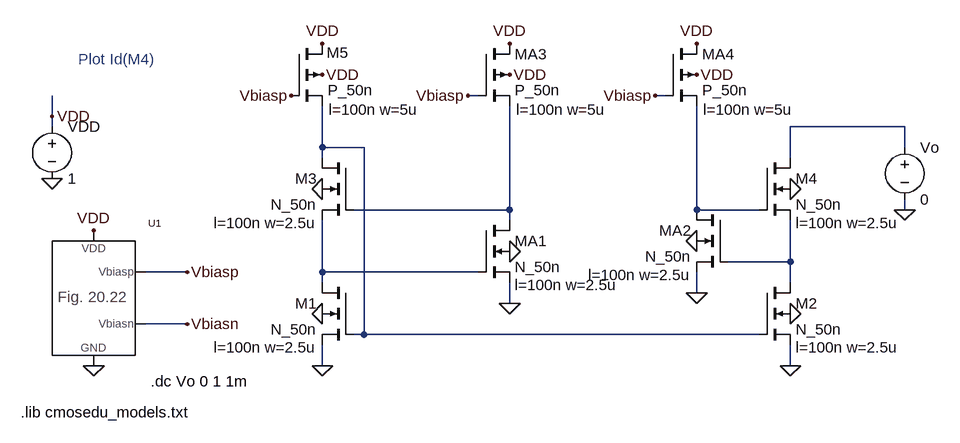
[diagram p0: schematic Fig20_42.asc]
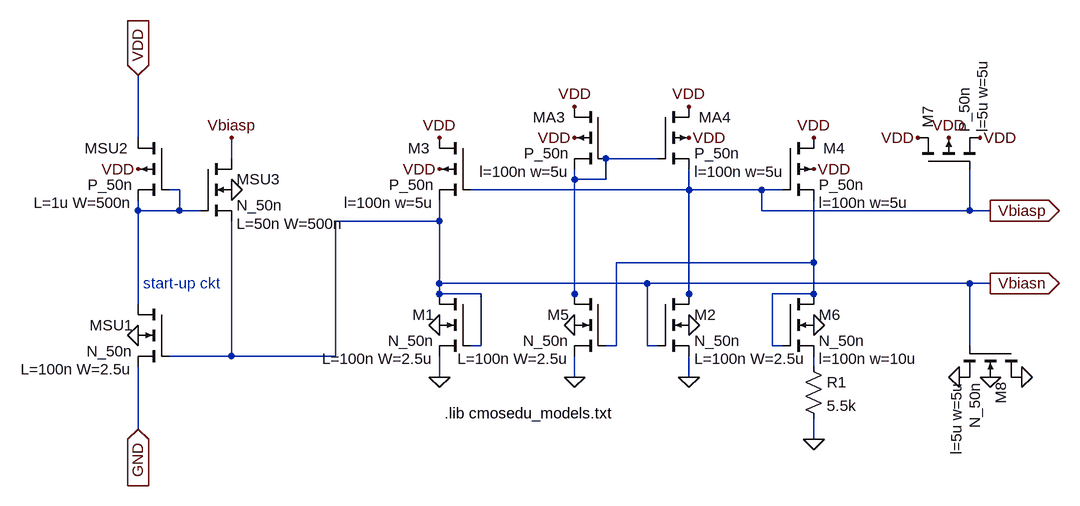
[diagram p1: sub-circuit fig_20_22.asc]
Fig20_42.asc, the LTspice schematic file:
Version 4
SHEET 1 1820 680
WIRE 448 -208 448 -240
WIRE 448 -192 448 -208
WIRE 656 32 592 32
WIRE 656 112 592 112
WIRE 864 -160 864 -224
WIRE 864 -144 864 -160
WIRE 864 32 864 -48
WIRE 864 48 864 32
WIRE 864 176 864 144
WIRE 928 -160 864 -160
WIRE 928 128 912 128
WIRE 928 128 928 -160
WIRE 1104 -240 1088 -240
WIRE 1104 32 864 32
WIRE 1152 -64 912 -64
WIRE 1152 -64 1152 -224
WIRE 1152 -48 1152 -64
WIRE 1152 80 1152 48
WIRE 1392 -240 1376 -240
WIRE 1440 -64 1440 -224
WIRE 1440 64 1440 32
WIRE 1536 -64 1440 -64
WIRE 1536 128 928 128
WIRE 1584 -144 1584 -192
WIRE 1584 16 1488 16
WIRE 1584 16 1584 -48
WIRE 1584 48 1584 16
WIRE 1584 176 1584 144
WIRE 1760 -192 1584 -192
WIRE 1760 -160 1760 -192
WIRE 1760 -64 1760 -80
FLAG 448 -112 0
FLAG 448 -208 VDD
FLAG 512 -32 VDD
FLAG 512 176 0
FLAG 656 32 Vbiasp
FLAG 656 112 Vbiasn
FLAG 1584 96 0
FLAG 1584 176 0
FLAG 1760 -64 0
FLAG 864 -96 0
FLAG 864 96 0
FLAG 864 176 0
FLAG 1584 -96 0
FLAG 864 -320 VDD
FLAG 816 -240 Vbiasp
FLAG 1152 -320 VDD
FLAG 1088 -240 Vbiasp
FLAG 864 -272 VDD
FLAG 1152 -272 VDD
FLAG 1152 0 0
FLAG 1152 80 0
FLAG 1440 -320 VDD
FLAG 1376 -240 Vbiasp
FLAG 1440 -272 VDD
FLAG 1440 -16 0
FLAG 1440 64 0
SYMBOL voltage 448 -208 R0
WINDOW 123 0 0 Left 0
WINDOW 39 0 0 Left 0
SYMATTR InstName VDD
SYMATTR Value 1
SYMBOL nmos4 1536 48 R0
WINDOW 123 56 100 Left 0
SYMATTR Value2 l=100n w=2.5u
SYMATTR InstName M2
SYMATTR Value N_50n
SYMBOL voltage 1760 -176 R0
SYMATTR InstName Vo
SYMATTR Value 0
SYMBOL Fig_20_22 448 80 R0
SYMATTR InstName U1
SYMBOL nmos4 912 -144 M0
WINDOW 123 56 100 Left 0
SYMATTR Value2 l=100n w=2.5u
SYMATTR InstName M3
SYMATTR Value N_50n
SYMBOL nmos4 912 48 M0
WINDOW 123 56 100 Left 0
SYMATTR Value2 l=100n w=2.5u
SYMATTR InstName M1
SYMATTR Value N_50n
SYMBOL nmos4 1536 -144 R0
WINDOW 123 56 100 Left 0
SYMATTR Value2 l=100n w=2.5u
SYMATTR InstName M4
SYMATTR Value N_50n
SYMBOL pmos4 816 -320 R0
WINDOW 123 58 102 Left 0
WINDOW 0 55 14 Left 0
SYMATTR Value2 l=100n w=5u
SYMATTR InstName M5
SYMATTR Value P_50n
SYMBOL pmos4 1104 -320 R0
WINDOW 123 58 102 Left 0
WINDOW 0 56 16 Left 0
SYMATTR Value2 l=100n w=5u
SYMATTR InstName MA3
SYMATTR Value P_50n
SYMBOL nmos4 1104 -48 R0
WINDOW 123 56 100 Left 0
SYMATTR Value2 l=100n w=2.5u
SYMATTR InstName MA1
SYMATTR Value N_50n
SYMBOL pmos4 1392 -320 R0
WINDOW 123 58 102 Left 0
WINDOW 0 56 16 Left 0
SYMATTR Value2 l=100n w=5u
SYMATTR InstName MA4
SYMATTR Value P_50n
SYMBOL nmos4 1488 -64 M0
WINDOW 123 56 100 Left 0
SYMATTR Value2 l=100n w=2.5u
SYMATTR InstName MA2
SYMATTR Value N_50n
TEXT 400 248 Left 0 !.lib cmosedu_models.txt
TEXT 488 -296 Left 0 ;Plot Id(M4)
TEXT 600 200 Left 0 !.dc Vo 0 1 1m

fig_20_22.asc, the sub-circuit schematic file:
Version 4
SHEET 1 1996 680
WIRE 544 -176 544 -272
WIRE 544 -64 544 -80
WIRE 544 80 544 -64
WIRE 544 272 544 176
WIRE 608 -96 592 -96
WIRE 608 -64 544 -64
WIRE 608 -64 608 -96
WIRE 640 -64 608 -64
WIRE 688 -144 688 -176
WIRE 688 160 592 160
WIRE 688 160 688 -48
WIRE 848 160 688 160
WIRE 848 160 848 -48
WIRE 1008 -48 848 -48
WIRE 1008 -48 1008 -80
WIRE 1008 48 1008 -48
WIRE 1008 64 1008 48
WIRE 1008 192 1008 160
WIRE 1072 64 1008 64
WIRE 1072 144 1056 144
WIRE 1072 144 1072 64
WIRE 1216 -112 1216 -128
WIRE 1216 64 1216 -112
WIRE 1216 80 1216 64
WIRE 1216 192 1216 160
WIRE 1264 -112 1216 -112
WIRE 1264 -112 1264 -144
WIRE 1280 144 1264 144
WIRE 1280 144 1280 16
WIRE 1328 48 1008 48
WIRE 1328 144 1328 48
WIRE 1344 -144 1264 -144
WIRE 1344 144 1328 144
WIRE 1392 -96 1056 -96
WIRE 1392 -96 1392 -128
WIRE 1392 64 1392 -96
WIRE 1392 80 1392 64
WIRE 1392 192 1392 160
WIRE 1504 -96 1392 -96
WIRE 1504 -64 1504 -96
WIRE 1520 144 1520 64
WIRE 1536 -96 1504 -96
WIRE 1536 144 1520 144
WIRE 1584 16 1280 16
WIRE 1584 16 1584 -80
WIRE 1584 64 1520 64
WIRE 1584 64 1584 16
WIRE 1584 176 1584 160
WIRE 1584 288 1584 256
WIRE 1824 -64 1504 -64
WIRE 1824 -64 1824 -128
WIRE 1824 48 1328 48
WIRE 1824 144 1824 48
WIRE 1856 -64 1824 -64
WIRE 1856 48 1824 48
FLAG 544 -128 VDD
FLAG 688 -176 Vbiasp
FLAG 1008 -128 VDD
FLAG 1008 -176 VDD
FLAG 1584 -128 VDD
FLAG 1584 -176 VDD
FLAG 1584 288 0
FLAG 1584 112 0
FLAG 1392 -176 VDD
FLAG 1392 -224 VDD
FLAG 1216 -176 VDD
FLAG 1216 -224 VDD
FLAG 1392 112 0
FLAG 1792 -176 VDD
FLAG 1744 -176 VDD
FLAG 1840 -176 VDD
FLAG 544 -272 VDD
IOPIN 544 -272 In
FLAG 544 272 GND
IOPIN 544 272 In
FLAG 688 -96 0
FLAG 544 128 0
FLAG 1008 192 0
FLAG 1008 112 0
FLAG 1216 112 0
FLAG 1216 192 0
FLAG 1856 192 0
FLAG 1904 192 0
FLAG 1808 192 0
FLAG 1392 192 0
FLAG 1856 -64 Vbiasp
IOPIN 1856 -64 Out
FLAG 1856 48 Vbiasn
IOPIN 1856 48 Out
SYMBOL pmos4 592 -176 M0
WINDOW 0 63 16 Left 0
WINDOW 123 56 100 Left 0
SYMATTR InstName MSU2
SYMATTR Value2 L=1u W=500n
SYMATTR Value P_50n
SYMBOL nmos4 592 80 M0
WINDOW 123 56 100 Left 0
SYMATTR Value2 L=100n W=2.5u
SYMATTR InstName MSU1
SYMATTR Value N_50n
SYMBOL nmos4 640 -144 R0
WINDOW 123 56 100 Left 0
SYMATTR Value2 L=50n W=500n
SYMATTR InstName MSU3
SYMATTR Value N_50n
SYMBOL pmos4 1056 -176 M0
WINDOW 0 63 16 Left 0
WINDOW 123 56 100 Left 0
SYMATTR InstName M3
SYMATTR Value2 l=100n w=5u
SYMATTR Value P_50n
SYMBOL pmos4 1536 -176 R0
WINDOW 0 63 16 Left 0
WINDOW 123 56 100 Left 0
SYMATTR InstName M4
SYMATTR Value2 l=100n w=5u
SYMATTR Value P_50n
SYMBOL nmos4 1056 64 M0
WINDOW 123 56 100 Left 0
SYMATTR Value2 L=100n W=2.5u
SYMATTR InstName M1
SYMATTR Value N_50n
SYMBOL res 1568 160 R0
SYMATTR InstName R1
SYMATTR Value 5.5k
SYMBOL pmos4 1344 -224 R0
WINDOW 0 63 16 Left 0
WINDOW 123 56 100 Left 0
SYMATTR InstName MA4
SYMATTR Value2 l=100n w=5u
SYMATTR Value P_50n
SYMBOL pmos4 1264 -224 M0
WINDOW 0 63 16 Left 0
WINDOW 123 56 100 Left 0
SYMATTR InstName MA3
SYMATTR Value2 l=100n w=5u
SYMATTR Value P_50n
SYMBOL nmos4 1264 64 M0
WINDOW 123 56 100 Left 0
SYMATTR Value2 L=100n W=2.5u
SYMATTR InstName M5
SYMATTR Value N_50n
SYMBOL pmos4 1744 -128 R270
WINDOW 0 63 16 Left 0
WINDOW 123 56 100 Left 0
SYMATTR InstName M7
SYMATTR Value2 l=5u w=5u
SYMATTR Value P_50n
SYMBOL nmos4 1904 144 R90
WINDOW 123 56 100 Left 0
SYMATTR Value2 l=5u w=5u
SYMATTR InstName M8
SYMATTR Value N_50n
SYMBOL nmos4 1344 64 R0
WINDOW 123 56 100 Left 0
SYMATTR Value2 L=100n W=2.5u
SYMATTR InstName M2
SYMATTR Value N_50n
SYMBOL nmos4 1536 64 R0
WINDOW 123 56 100 Left 0
SYMATTR Value2 l=100n w=10u
SYMATTR InstName M6
SYMATTR Value N_50n
TEXT 552 48 Left 0 ;start-up ckt
TEXT 1016 248 Left 0 !.lib cmosedu_models.txt

The netlist it stands for:
* Fig20_42.asc
VDD VDD 0 1
M2 N006 N001 0 0 N_50n l=100n w=2.5u
Vo N005 0 0
XU1 Vbiasn Vbiasp VDD 0 fig_20_22
M3 N001 N003 N002 0 N_50n l=100n w=2.5u
M1 N002 N001 0 0 N_50n l=100n w=2.5u
M4 N005 N004 N006 0 N_50n l=100n w=2.5u
M5 VDD Vbiasp N001 VDD P_50n l=100n w=5u
MA3 VDD Vbiasp N003 VDD P_50n l=100n w=5u
MA1 N003 N002 0 0 N_50n l=100n w=2.5u
MA4 VDD Vbiasp N004 VDD P_50n l=100n w=5u
MA2 N004 N006 0 0 N_50n l=100n w=2.5u

* block symbol definitions
.subckt fig_20_22 Vbiasn Vbiasp VDD GND
MSU2 VDD N001 N001 VDD P_50n L=1u W=500n
MSU1 N001 Vbiasn GND 0 N_50n L=100n W=2.5u
MSU3 Vbiasp N001 Vbiasn 0 N_50n L=50n W=500n
M3 VDD Vbiasp Vbiasn VDD P_50n l=100n w=5u
M4 VDD Vbiasp N003 VDD P_50n l=100n w=5u
M1 Vbiasn Vbiasn 0 0 N_50n L=100n W=2.5u
R1 N004 0 5.5k
MA4 VDD N002 Vbiasp VDD P_50n l=100n w=5u
MA3 VDD N002 N002 VDD P_50n l=100n w=5u
M5 N002 N003 0 0 N_50n L=100n W=2.5u
M7 VDD Vbiasp VDD VDD P_50n l=5u w=5u
M8 0 Vbiasn 0 0 N_50n l=5u w=5u
M2 Vbiasp Vbiasn 0 0 N_50n L=100n W=2.5u
M6 N003 N003 N004 0 N_50n l=100n w=10u
* start-up ckt
.lib cmosedu_models.txt
.ends fig_20_22

.model NMOS NMOS
.model PMOS PMOS
.lib standard.mos
.lib cmosedu_models.txt
* Plot Id(M4)
.dc Vo 0 1 1m
.backanno
.end